# EAGLE schematic Acc+Comp (EAGLE 7.2.0)
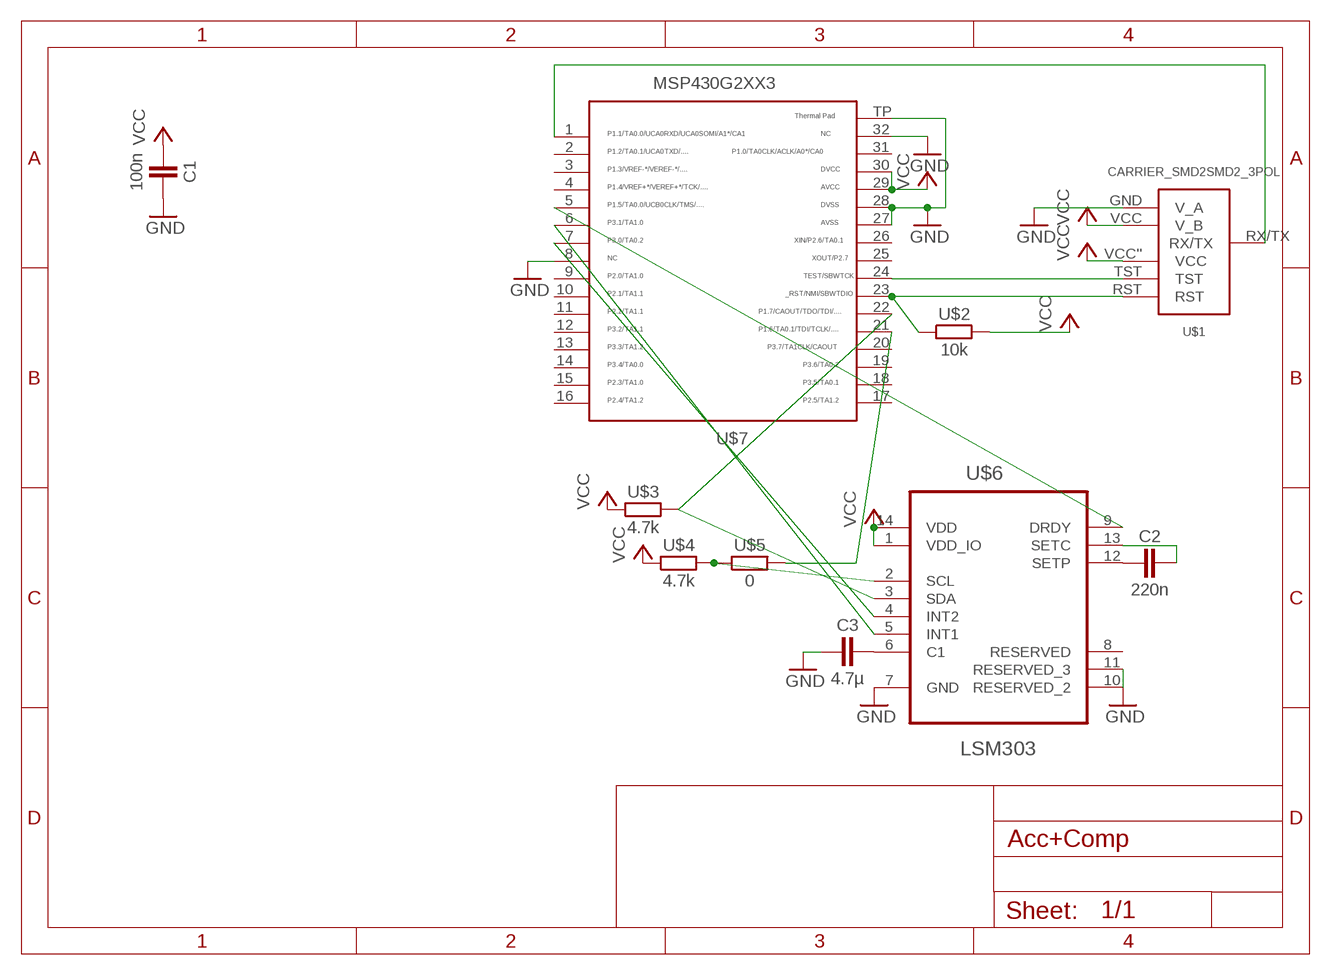
[diagram p0: schematic, sheet 1]

## Parts
C1  100n  CAPACITOR  [603]
C2  220n  CAPACITOR  [603]
C3  4.7µ  CAPACITOR  [603]
U$1  CARRIER_SMD2SMD2_3POL  [CARRIER_SMD2_3POL]
U$2  10k  RESISTOR0603  [603]
U$3  4.7k  RESISTOR0603  [603]
U$4  4.7k  RESISTOR0603  [603]
U$5  0  RESISTOR0603  [603]
U$6  LSM303  [LSM303]
U$7  MSP430G2553  [QFN32]

## Nets
GND: C1.2 C3.1 U$1.GND(V_A) U$6.7(GND) U$6.10(RESERVED_2) U$6.11(RESERVED_3) U$7.8 U$7.27 U$7.28 U$7.32 U$7.TP
N$2: U$3.2 U$6.3(SDA) U$7.22
N$3: U$1.TST U$7.24
N$4: U$1.RST U$2.1 U$7.23
N$5: U$5.2 U$7.21
N$6: C2.1 U$6.12(SETP)
N$7: C2.2 U$6.13(SETC)
N$11: C3.2 U$6.6(C1)
N$12: U$1.RX/TX U$7.1
N$13: U$6.5(INT1) U$7.6
N$14: U$6.4(INT2) U$7.7
N$16: U$6.9(DRDY) U$7.5
N$17: U$4.2 U$5.1 U$6.2(SCL)
VCC: C1.1 U$1.VCC''(VCC) U$1.VCC(V_B) U$2.2 U$3.1 U$4.1 U$6.1(VDD_IO) U$6.14(VDD) U$7.29 U$7.30
Unconnected: U$6.8(RESERVED) U$7.2 U$7.3 U$7.4 U$7.9 U$7.10 U$7.11 U$7.12 U$7.13 U$7.14 U$7.15 U$7.16 U$7.17 U$7.18 U$7.19 U$7.20 U$7.25 U$7.26 U$7.31

## Library data of the parts
C1-C3 = thar:CAPACITOR
U$1 = thar:CARRIER_SMD2
U$2-U$5 = thar:RESISTOR
U$6 = thar:LSM303: Beschleunigungsmesser E-compass 3D accel & 3D magnetometer mod. Mouser Best.Nr.: 511-LSM303DLHC Herst.Bez.: LSM303DLHC
U$7 = thar:MSP430G2553: TEXAS INSTRUMENTS MSP430G2553IRHB32R MCU, 16BIT, MSP430, 16MHZ, QFN-32 Farnell Best.Nr.: 2325726 Herst.Bez.: MSP430G2553IRHB32R